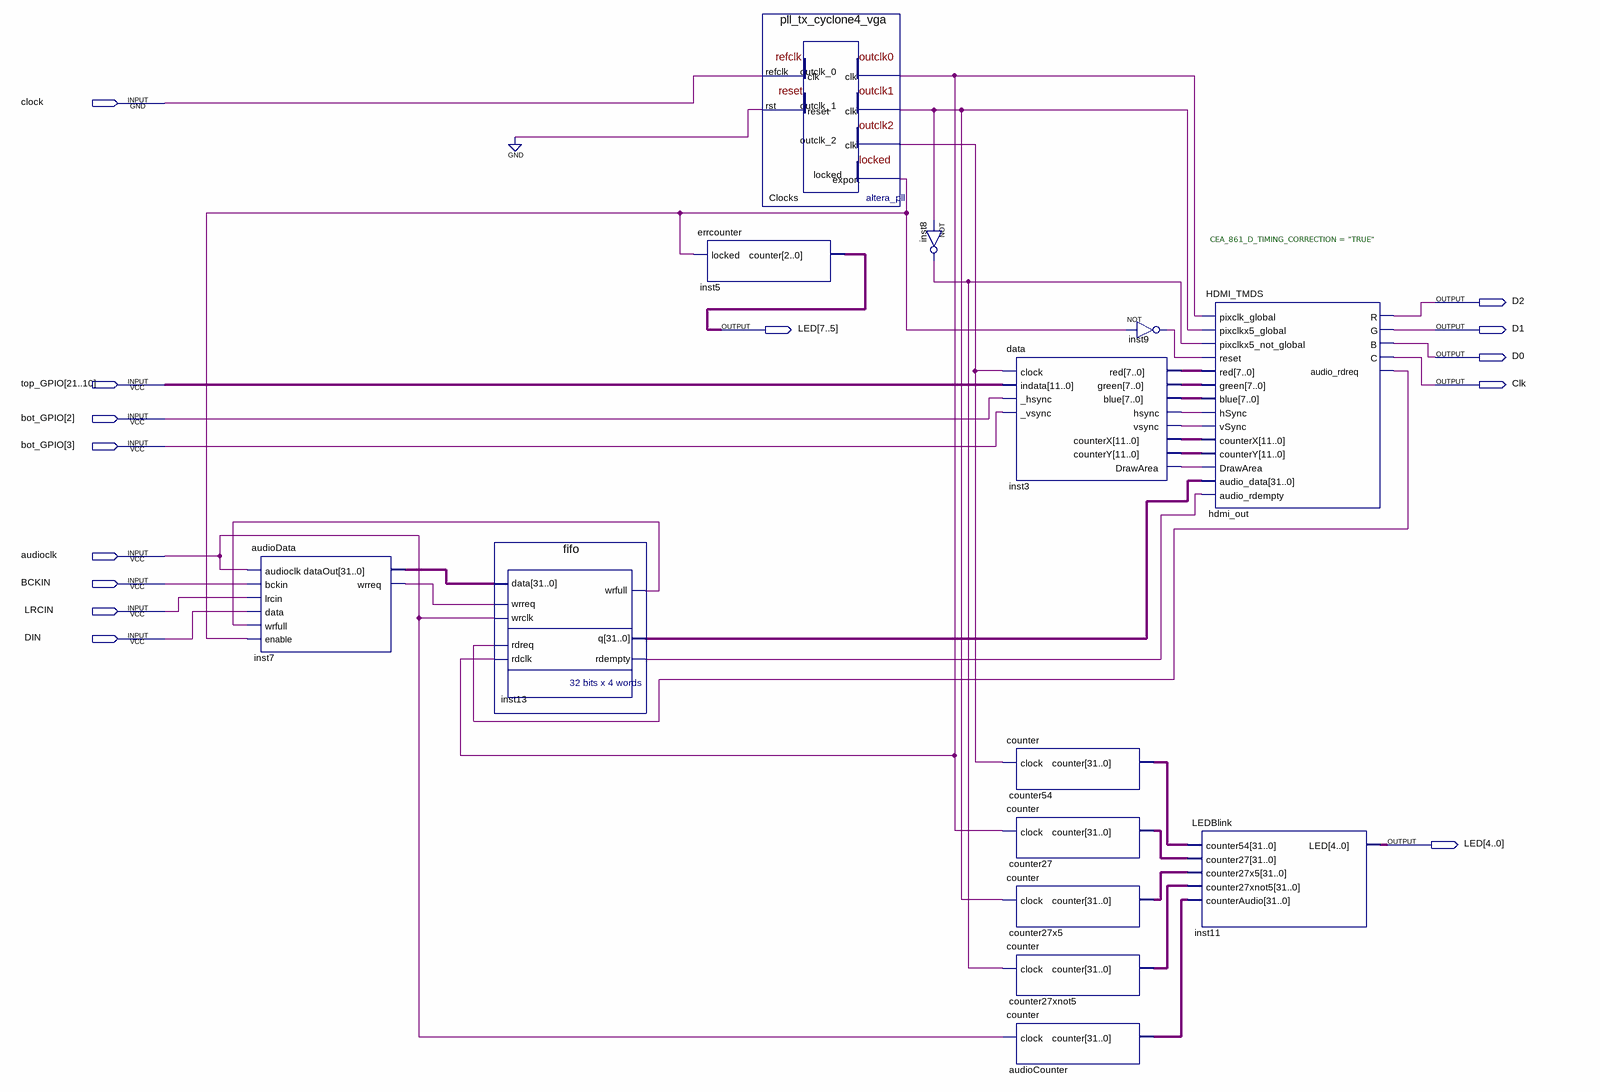
[diagram p0: schematic sheet]
// Quartus schematic Top.bdf as structural Verilog: 14 symbols, 14 pins
module Top (
  input  clock,
  input  [21:10] top_GPIO,
  input  [3:2] bot_GPIO,
  input  audioclk,
  input  BCKIN,
  input  LRCIN,
  input  DIN,
  output D2,
  output [7:0] LED,
  output D1,
  output D0,
  output Clk
);

  wire Clocks_locked, Clocks_outclk_0, Clocks_outclk_1, Clocks_outclk_2, hdmi_out_audio_rdreq,
       inst3_drawarea, inst3_hsync, inst3_vsync, inst7_wrreq, inst8_out, inst9_out, inst13_rdempty,
       inst13_wrfull;
  wire [7:0] inst3_blue, inst3_green, inst3_red;
  wire [11:0] inst3_counterx, inst3_countery;
  wire [31:0] audioCounter_counter, counter27_counter, counter27x5_counter, counter27xnot5_counter,
       counter54_counter, inst7_dataout, inst13_q;

  audioData inst7 (
    .audioclk(audioclk), .bckin(BCKIN), .lrcin(LRCIN), .data(DIN), .wrfull(inst13_wrfull),
    .enable(Clocks_locked), .dataOut(inst7_dataout), .wrreq(inst7_wrreq));
  fifo inst13 (
    .data(inst7_dataout), .wrreq(inst7_wrreq), .wrclk(audioclk), .rdreq(hdmi_out_audio_rdreq),
    .rdclk(Clocks_outclk_0), .wrfull(inst13_wrfull), .q(inst13_q), .rdempty(inst13_rdempty));
  errcounter inst5 (.locked(Clocks_locked), .counter(LED[7:5]));
  pll_tx_cyclone4_vga Clocks (
    .refclk(clock), .rst(1'b0), .outclk_0(Clocks_outclk_0), .outclk_1(Clocks_outclk_1),
    .outclk_2(Clocks_outclk_2), .locked(Clocks_locked));
  not inst8 (inst8_out, Clocks_outclk_1);
  data #(.CEA_861_D_TIMING_CORRECTION("TRUE")) inst3 (
    .clock(Clocks_outclk_2), .indata(top_GPIO), ._hsync(bot_GPIO[2]), ._vsync(bot_GPIO[3]), .red(inst3_red),
    .green(inst3_green), .blue(inst3_blue), .hsync(inst3_hsync), .vsync(inst3_vsync),
    .counterX(inst3_counterx), .counterY(inst3_countery), .DrawArea(inst3_drawarea));
  counter counter54 (.clock(Clocks_outclk_2), .counter(counter54_counter));
  counter counter27 (.clock(Clocks_outclk_0), .counter(counter27_counter));
  counter counter27x5 (.clock(Clocks_outclk_1), .counter(counter27x5_counter));
  counter counter27xnot5 (.clock(inst8_out), .counter(counter27xnot5_counter));
  counter audioCounter (.clock(audioclk), .counter(audioCounter_counter));
  not inst9 (inst9_out, Clocks_locked);
  HDMI_TMDS hdmi_out (
    .pixclk_global(Clocks_outclk_0), .pixclkx5_global(Clocks_outclk_1), .pixclkx5_not_global(inst8_out),
    .reset(inst9_out), .red(inst3_red), .green(inst3_green), .blue(inst3_blue), .hSync(inst3_hsync),
    .vSync(inst3_vsync), .counterX(inst3_counterx), .counterY(inst3_countery), .DrawArea(inst3_drawarea),
    .audio_data(inst13_q), .audio_rdempty(inst13_rdempty), .R(D2), .G(D1), .B(D0), .C(Clk),
    .audio_rdreq(hdmi_out_audio_rdreq));
  LEDBlink inst11 (
    .counter54(counter54_counter), .counter27(counter27_counter), .counter27x5(counter27x5_counter),
    .counter27xnot5(counter27xnot5_counter), .counterAudio(audioCounter_counter), .LED(LED[4:0]));
endmodule
